# EAGLE design displayboard (EAGLE 8.2.1)
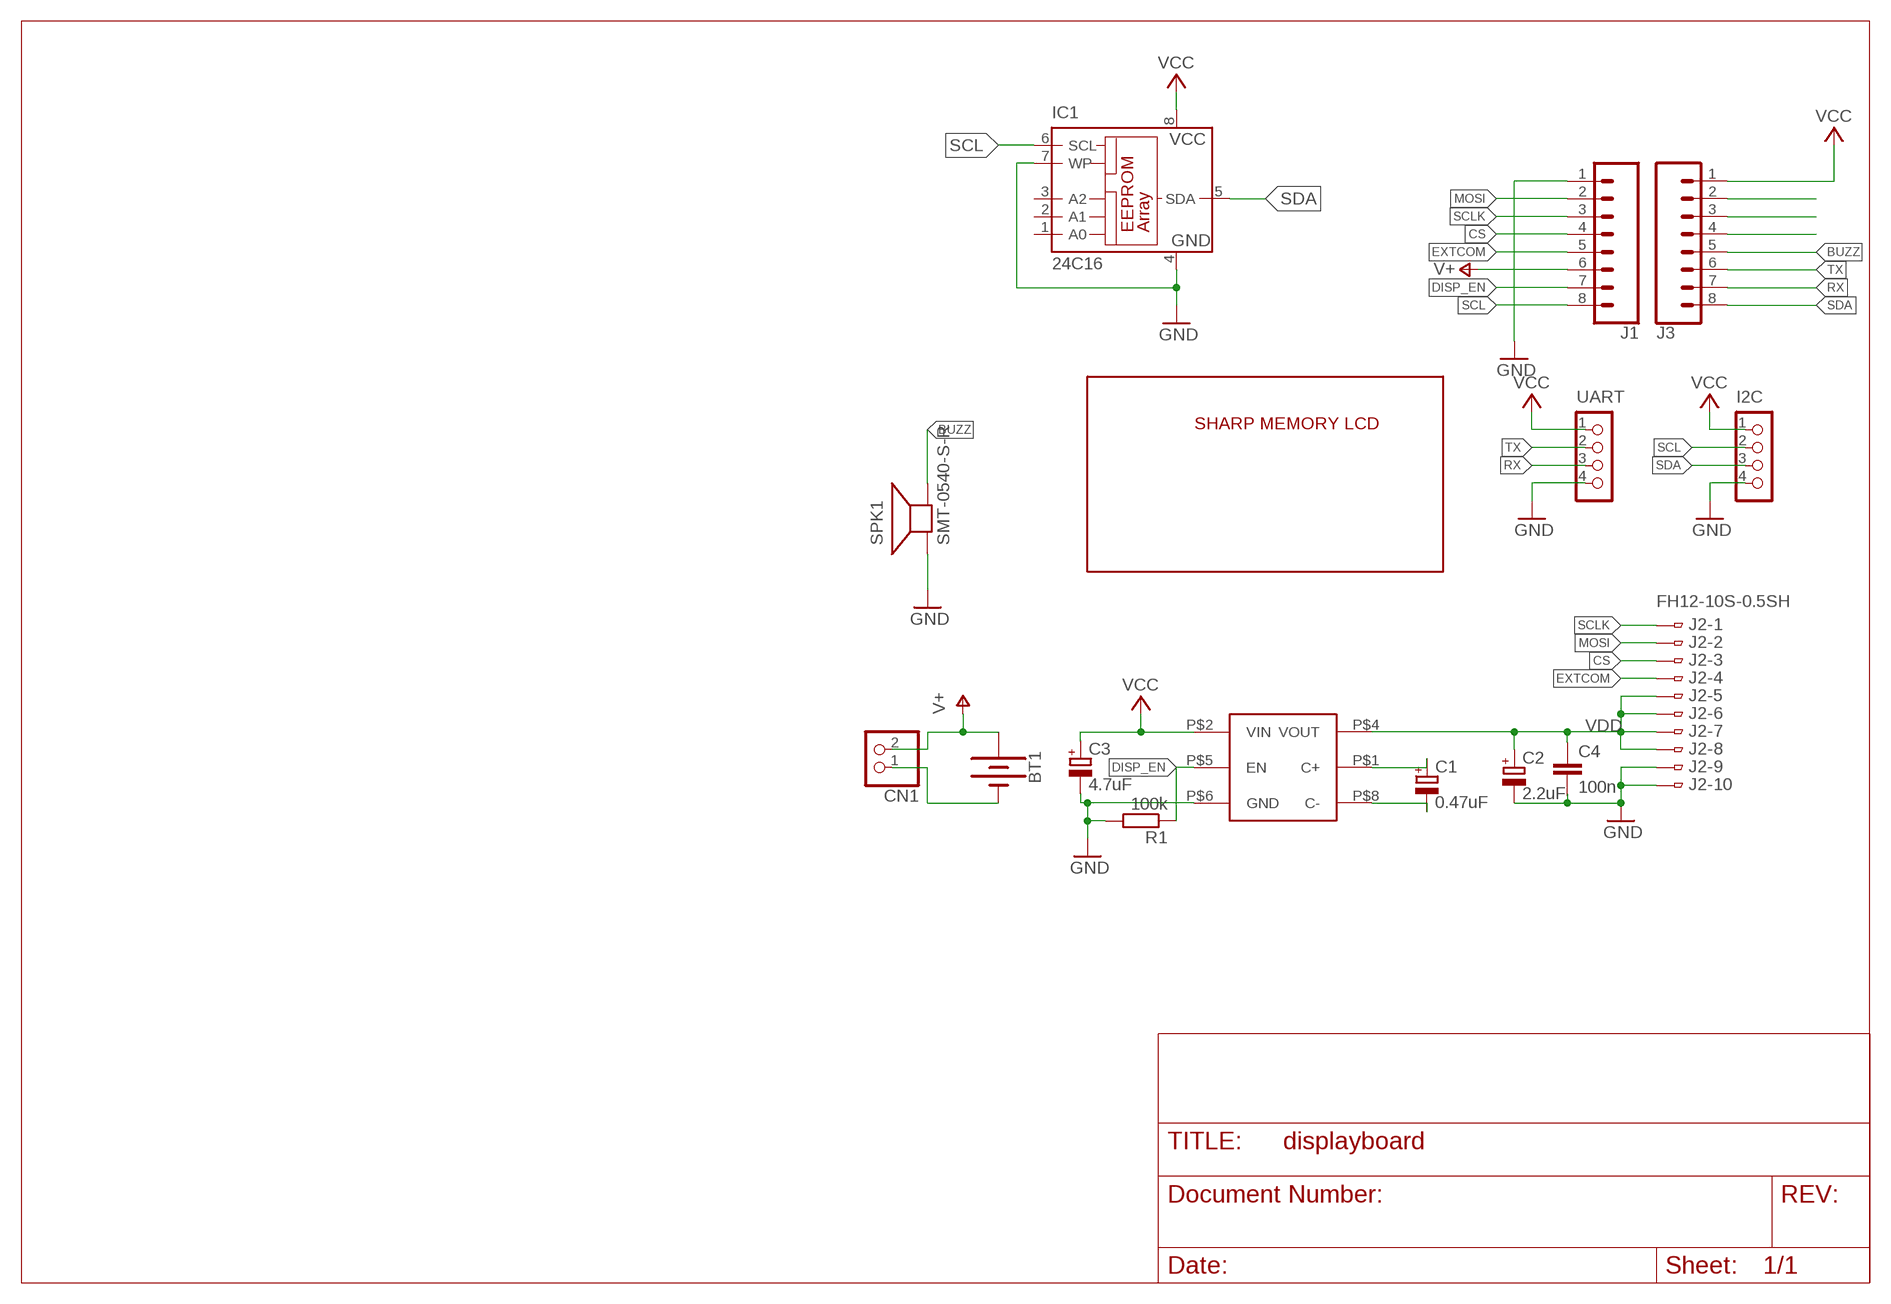
[diagram p0: schematic, sheet 1]

## Parts
BT1  BATTERY-18650  [BATTERY_18650-HOLDER]
C1  0.47uF  CPOL-EUC/6032-28R  [C/6032-28R]
C2  2.2uF  CPOL-EUC/6032-28R  [C/6032-28R]
C3  4.7uF  CPOL-EUC/6032-28R  [C/6032-28R]
C4  100n  C-EUC1206K  [C1206K]
CN1  PINHD-1X2  [1X02]
I2C  CON_HEADER_1X04  [M1X4]
IC1  24C16  24C04SN  [SO-08]
J1  CONN_08SMD-COMBO-FEMALE  [1X08_SMD_COMBINED]
J2  FH12-10S-0.5SH  [FH12-10S-0.5SH]
J3  CONN_08SMD-COMBO-FEMALE  [1X08_SMD_COMBINED]
R1  100k  R-EU_R0805  [R0805]
SPK1  SMT-0540-S-R  [SMT-0540-S-R]
U$1  S8821  [SNT-8A]
U$2  MEMORYLCD  [LS027B7DH01]
UART  CON_HEADER_1X04  [M1X4]

## Nets
BUZZ: J3.5 SPK1.+(-)
CS: J1.4 J2.3
DISP_EN: J1.7 R1.1 U$1.P$5(EN)
EXTCOM: J1.5 J2.4
GND: C2.- C3.- C4.2 I2C.4 IC1.4(GND) IC1.7(WP) J1.1 J2.9 J2.10 R1.2 SPK1.-(+) U$1.P$6(GND) UART.4
MOSI: J1.2 J2.2
N$1: J3.2
N$2: C1.+ U$1.P$1(C+)
N$4: C1.- U$1.P$8(C-)
N$5: BT1.GND@1(-) CN1.1
N$9: J3.3
N$10: J3.4
RX: J3.7 UART.3
SCL: I2C.2 IC1.6(SCL) J1.8
SCLK: J1.3 J2.1
SDA: I2C.3 IC1.5(SDA) J3.8
TX: J3.6 UART.2
V+: BT1.PWR@1(+) CN1.2 J1.6
VCC: C3.+ I2C.1 IC1.8(VCC) J3.1 U$1.P$2(VIN) UART.1
VDD: C2.+ C4.1 J2.5 J2.6 J2.7 J2.8 U$1.P$4(VOUT)
Unconnected: IC1.1(A0) IC1.2(A1) IC1.3(A2)

## Library data of the parts
BT1 = SparkFun-Batteries:BATTERY: Battery - Single Cell A variety of battery chemistries, sizes, and footprints. Device List: 20MM_PTH - Coin Cell Battery Holder - 20mm (PTH) <https://www.sparkfun.com/products/783> 12MM_SMD - Coin Cell Battery Holder - 12mm (SMD) <https://www.sparkfun.com/products/10592> 12MM_PTH - Coin Cell Battery Holder - 12mm (PTH) <https://www.sparkfun.com/products/7948> 20MM_SMD - 20mm Coin Cell Battery Holder (SMD) (2 legs) Used on the Big Time Watch Kit <https://www.sparkfun.com/products/11734> 20MM_SMD_4LEGS - Coin Cell Battery Holder - 20mm (SMD) <https://www.sparkfun.com/products/11892> 20MM_SMD_4LEGS_OVERPASTE - Coin Cell Battery Holder - 20mm (SMD) <https://www.sparkfun.com/products/11892> (Over-paste on the legs) 24.5MM_PTH - Coin Cell Battery Holder - 24.5mm (PTH) <https://www.sparkfun.com/products/8863> 9V - 9V Battery Holder - PC Mount Used on the SparkFun SparkPunk Sound Kit <https://www.sparkfun.com/products/11177> and SparkFun SparkPunk Sequencer Kit <https://www.sparkfun.com/products/12707> 18650 - Battery Holder - 18650 (PTH) <https://www.sparkfun.com/products/13113> AA - Battery Holder - 1xAA (PTH) <https://www.sparkfun.com/products/7949> AAA - Battery Holder - 1xAAA (PTH) <https://www.sparkfun.com/products/12718> AA_KIT - Battery Holder - 1xAA (PTH) <https://www.sparkfun.com/products/7949> Special kit package - pads only have exposed copper on one side of the board. AAA_KIT - Battery Holder - 1xAAA (PTH) <https://www.sparkfun.com/products/12718> Special kit package - pads only have exposed copper on one side of the board.; PROD_ID: BATT-12327; SF_SKU: PRT-13113
C1-C3 = rcl:CPOL-EU: POLARIZED CAPACITOR, European symbol
C4 = rcl:C-EU: CAPACITOR, European symbol
CN1 = pinhead:PINHD-1X2: PIN HEADER
I2C UART = dp_devices.v6:CON_HEADER_1X04
IC1 = microchip:24C*: Serial EEPROM 1 K/2 K/4 K; MPN: M24C04-WMN6P; OC_FARNELL: 9882812; OC_NEWARK: 83K1376
J1 J3 = SparkFun-Connectors:CONN_08: Multi connection point. Often used as Generic Header-pin footprint for 0.1 inch spaced/style header connections On any of the 0.1 inch spaced packages, you can populate with these: Break Away Headers - Straight <https://www.sparkfun.com/products/116> (PRT-00116) Break Away Male Headers - Right Angle <https://www.sparkfun.com/products/553> (PRT-00553) Female Headers <https://www.sparkfun.com/products/115> (PRT-00115) Break Away Headers - Machine Pin <https://www.sparkfun.com/products/117> (PRT-00117) Break Away Female Headers - Swiss Machine Pin <https://www.sparkfun.com/products/743> (PRT-00743) Arduino Stackable Header - 8 Pin <https://www.sparkfun.com/products/9279> (PRT-09279) For SCREWTERMINALS and SPRING TERMINALS visit here: Screw Terimnals on SparkFun.com <https://www.sparkfun.com/search/results?term=Screw+Terminals> (5mm/3.5mm/2.54mm spacing) This device is also useful as a general connection point to wire up your design to another part of your project. Our various solder wires solder well into these plated through hole pads. Hook-Up Wire - Assortment (Stranded, 22 AWG) <https://www.sparkfun.com/products/11375> (PRT-11375) Hook-Up Wire - Assortment (Solid Core, 22 AWG) <https://www.sparkfun.com/products/11367> (PRT-11367) View the entire wire category on our website here <https://www.sparkfun.com/categories/141> Special notes: Molex polarized connector foot print use with SKU : PRT-08231 with associated crimp pins and housings. 1MM SMD Version SKU: PRT-10208 NOTES ON THE VARIANTS LOCK and LOCK_LONGPADS... This footprint was designed to help hold the alignment of a through-hole component (i.e. 6-pin header) while soldering it into place. You may notice that each hole has been shifted either up or down by 0.005 of an inch from it's more standard position (which is a perfectly straight line). This slight alteration caused the pins (the squares in the middle) to touch the edges of the holes. Because they are alternating, it causes a "brace" to hold the component in place. 0.005 has proven to be the perfect amount of "off-center" position when using our standard breakaway headers. Although looks a little odd when you look at the bare footprint, once you have a header in there, the alteration is very hard to notice. Also,if you push a header all the way into place, it is covered up entirely on the bottom side.; PROD_ID: CONN-10204; SF_ID: PRT-11543
J2 = con-hirose:FH12-10S-0.5S: 0.5mm Pitch Connectors For FPC/FFC Source: Data sheet <http://www.hirose.co.jp/cataloge_hp/e58605370.pdf>; MPN: FH12-10S-0.5SH(55); OC_FARNELL: 1324540; OC_NEWARK: 34M6152
R1 = rcl:R-EU_: RESISTOR, European symbol
SPK1 = adafruit:SMT-0540-S-R: SMT-0549-S-R Small surface-mount magnetic buzzer
U$1 = SparkFun-Batteries:S8821
U$2 = SparkFun-Electromechanical:MEMORYLCD

## Board
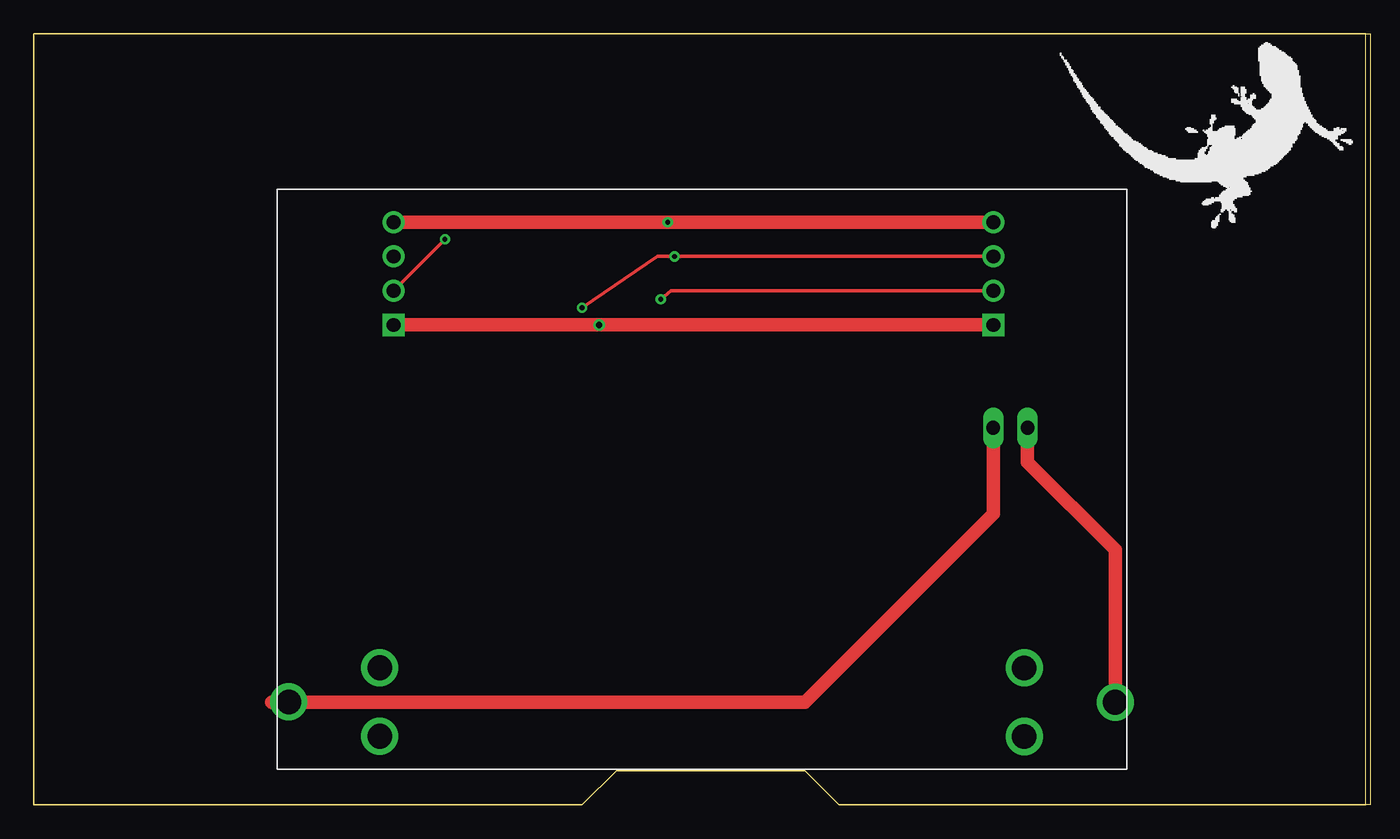
[diagram p1: board, top side]
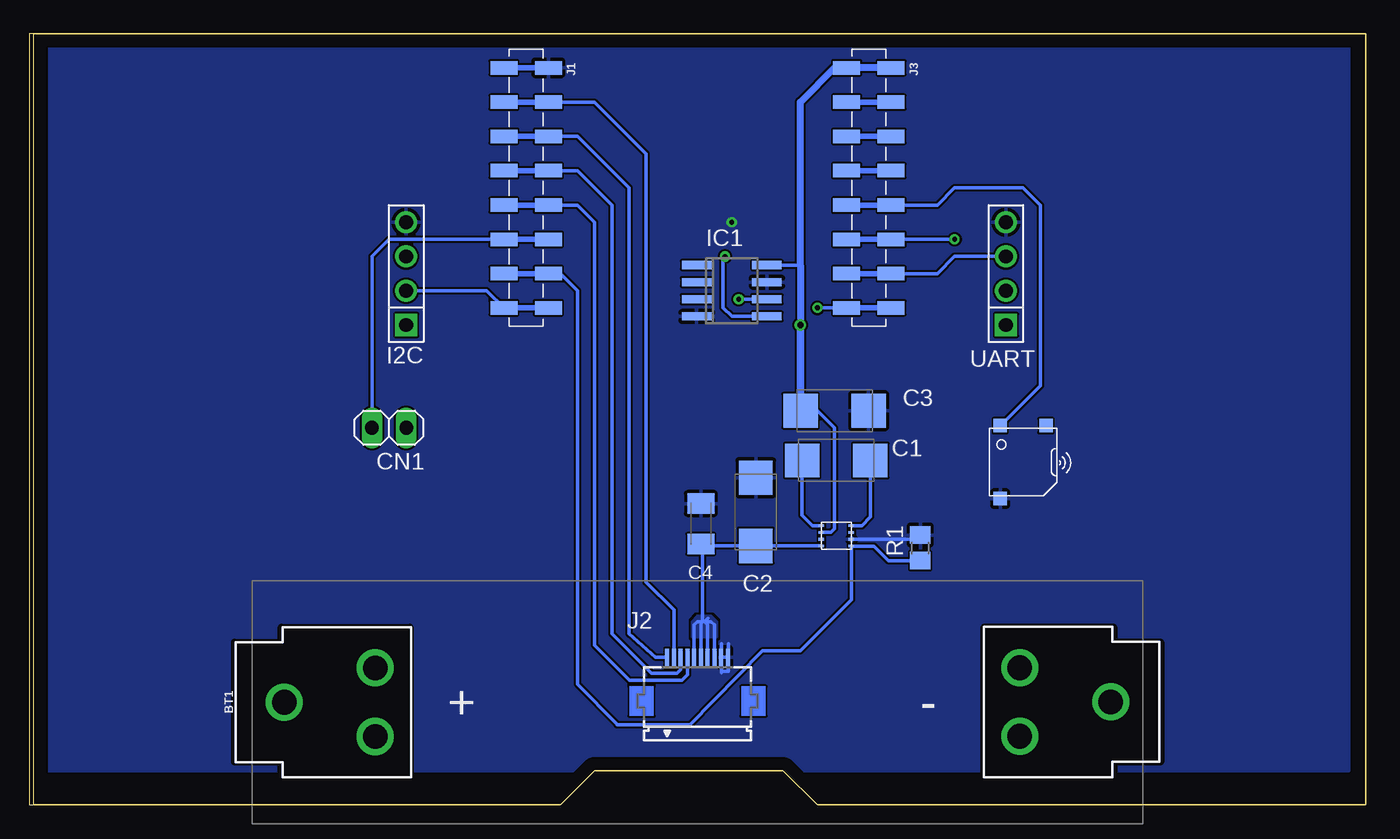
[diagram p2: board, bottom side, seen from below]

Size 98.73 x 57.14 mm. Coordinates in mm from the lower left corner, seen from the top.
Outline: 0,0 40.64,0 43.18,2.54 57.15,2.54 59.69,0 98.73,0 98.73,57.14 0,57.14 0,0
Copper layers (1*16): Top 0.035mm / dielectric 1.5mm / Bottom 0.035mm
Design rules "default *": minimum track width 6mil, minimum drill 0.35mm, track to track 6mil, track to pad 6mil, pad to pad 6mil, via to via 6mil, smd to smd 6mil, copper to edge 40mil, drill to drill 6mil, minimum pad ring 10mil, minimum via ring 8mil, stop-mask expansion 3mil, vias tented up to drill 0mil, thermal gap 10mil
Milling: 8 lines

### Footprints (pad centres in the part's own frame; a part is rotated, then mirrored left to right if it is on the bottom)
BATTERY_18650-HOLDER = drill 1.829: GND@1 30.628,0.01; GND@2 23.88,2.55; GND@3 23.88,-2.53; PWR@1 -30.628,-0.01; PWR@2 -23.88,2.53; PWR@3 -23.88,-2.55
C/6032-28R = smd 2.55 x 2.5: + 2.525,0; - -2.525,0
C1206K = smd 1.5 x 2: 1 -1.5,0; 2 1.5,0
1X02 = drill 1.016 long: 1 -1.27,0; 2 1.27,0
M1X4 = drill 1.02 pad 1.632 square: 1 0,0 | drill 1.02 pad 1.632: 2 2.54,0; 3 5.08,0; 4 7.62,0
SO-08 = smd 0.6 x 2.2: 1 -1.905,-2.6; 2 -0.635,-2.6; 3 0.635,-2.6; 4 1.905,-2.6; 5 1.905,2.6; 6 0.635,2.6; 7 -0.635,2.6; 8 -1.905,2.6
1X08_SMD_COMBINED = smd 1 x 2: 1 0,1.65; 1@2 0,-1.65; 2 2.54,-1.65; 2@2 2.54,1.65; 3 5.08,1.65; 3@2 5.08,-1.65; 4 7.62,-1.65; 4@2 7.62,1.65; 5 10.16,1.65; 5@2 10.16,-1.65; 6 12.7,-1.65; 6@2 12.7,1.65; 7 15.24,1.65; 7@2 15.24,-1.65; 8 17.78,-1.65; 8@2 17.78,1.65
FH12-10S-0.5SH = smd 0.3 x 1.3: 1 -2.25,3.25; 2 -1.75,3.25; 3 -1.25,3.25; 4 -0.75,3.25; 5 -0.25,3.25; 6 0.25,3.25; 7 0.75,3.25; 8 1.25,3.25; 9 1.75,3.25; 10 2.25,3.25
R0805 = smd 1.3 x 1.5: 1 -0.95,0; 2 0.95,0
SMT-0540-S-R = smd 1 x 1: + 1.7,-2.7; - 1.7,2.7; M -1.7,-2.7
SNT-8A = smd 0.406 x 0.203: P$1 -1.118,0.762; P$2 -1.118,0.254; P$3 -1.118,-0.254; P$4 -1.118,-0.762; P$5 1.118,-0.762; P$6 1.118,-0.254; P$7 1.118,0.254; P$8 1.118,0.762

### Placement (x,y rotation side)
BT1  49.53,7.62 0 bottom
C1  39.24,25.53 180 bottom
C2  45.21,21.72 270 bottom
C3  39.37,29.21 180 bottom
C4  49.28,20.83 90 bottom
CN1  72.39,27.94 180 bottom
I2C  71.12,35.56 90 bottom
IC1  46.99,38.1 270 bottom
J1  62.23,54.61 270 bottom
J2  49.53,7.69 0 bottom
J3  36.83,54.61 270 bottom
R1  33.02,19.05 90 bottom
SPK1  25.4,25.4 180 bottom
U$1  39.24,19.94 0 bottom
U$2  49.53,24.13 0 top
UART  26.67,35.56 90 bottom

### Tracks (layer width: path | path; a pad name or v marks a point on that pad's centre or on a via)
BUZZ
  Bottom 0.254: SPK1.+ 24.13,31.07 24.13,44.45 25.4,45.72 30.48,45.72 31.75,44.45 J3.5
CS
  Bottom 0.254: J2.3 50.78,10.02 51.05,9.75 52.93,9.75 55.88,12.7 55.88,44.45 58.42,46.99 J1.4
DISP_EN
  Bottom 0.254: R1.1 35.37,18.1 36.45,19.18 U$1.P$5 38.12,15.21 41.91,11.43 44.72,11.43 50.1,5.95 55.48,5.95 55.48,5.99 58.42,8.93 58.42,38.1 59.69,39.37 J1.7
EXTCOM
  Bottom 0.254: J2.4 50.28,9.63 50.67,9.24 54.56,9.24 57.15,11.83 57.15,43.18 58.42,44.45 J1.5
GND  (via drill 0.35)
  Top 1.016: UART.4 v46.99,43.18 I2C.4
  Bottom 0.254: J2.10 J2.9 | U$1.P$6 33.66,19.68 33.02,20.32 | 47.75,11.94 47.75,10.92 47.76,10.92 J2.9 | J2.9 47.75,10.91 47.75,9.78 47.62,9.91 47.24,9.91 47.24,11.94
  pour Bottom (isolate 0.152, rank 2): 1.27,58.42 97.79,58.42 97.79,2.54 1.27,2.54
MOSI
  Bottom 0.254: J2.2 51.28,14.45 53.34,16.51 53.34,48.26 57.15,52.07 J1.2
N$2
  Bottom 0.152: 41.78,25.51 C1.+
  Bottom 0.254: U$1.P$1 41.02,20.7 41.78,21.46 41.78,25.51
N$4
  Bottom 0.152: 36.7,25.51 C1.-
  Bottom 0.254: U$1.P$8 37.34,20.7 36.7,21.34 36.7,25.51
N$5
  Top 1.016: CN1.1 71.12,21.59 57.15,7.62 17.64,7.62 BT1.GND@1
RX
  Bottom 0.254: UART.3 30.48,40.64 31.75,39.37 35.08,39.37
  Bottom 0.508: J3.7 35.08,39.37
SCL  (via drill 0.35)
  Top 0.254: v46.48,37.47 47.24,38.1 I2C.2
  Bottom 0.254: I2C.2 65.15,38.1 J1.8 | IC1.6 v46.48,37.47
SCLK
  Bottom 0.254: J2.1 52.65,10.94 54.61,12.7 54.61,45.72 58.42,49.53 J1.3
SDA  (via drill 0.35)
  Top 0.254: v40.64,36.83 46.23,40.64 v47.5,40.64 I2C.3
  Bottom 0.254: 38.5,36.83 38.48,36.45 | 38.5,36.83 v40.64,36.83 | IC1.5 46.99,36.2 47.62,36.83 47.62,40.64 v47.5,40.64 | J3.8 38.5,36.83
TX  (via drill 0.35)
  Top 0.254: v30.48,41.91 UART.2
  Bottom 0.254: J3.6 v30.48,41.91
V+
  Top 1.016: CN1.2 73.66,25.4 80.16,18.9 BT1.PWR@1
  Bottom 0.254: CN1.2 73.66,40.64 72.39,41.91 J1.6
VCC  (via drill 0.45)
  Top 1.016: I2C.1 v41.91,35.56 UART.1
  Bottom 0.254: C3.+ 40.64,29.21 39.37,27.94 39.37,20.45 39.62,20.19 U$1.P$2 | IC1.8 41.91,40.01
  Bottom 0.508: C3.+ 41.91,29.23 v41.91,35.56 | v41.91,35.56 41.91,40.01 41.91,52.07 39.37,54.61 J3.1 | 41.91,29.21 v41.91,35.56
VDD
  Bottom 0.152: 49.15,13.59 49.02,13.59 | 48.77,12.13 J2.7
  Bottom 0.254: J2.8 48.28,13.36 48.51,13.59 49.02,13.59 | 49.15,13.59 49.53,13.59 49.78,13.34 49.78,12.14 J2.5 | J2.6 49.28,13.46 49.15,13.59 | J2.7 48.78,13.35 49.02,13.59 | 48.77,13.84 49.02,13.59 | U$1.P$4 40.38,19.19 C2.+ 49.14,19.19 49.15,19.2 | C4.1 49.15,19.2 | 49.15,19.2 49.15,13.59
  pour Bottom: 48.13,12.45 48.13,13.59 48.51,13.97 49.53,13.97 49.91,13.59 49.91,12.45

### Text on the board
tValues: Meeting Room Monitor | A Hack-A-Gecko project | by Steven Cooreman
bValues: RX | SDA | TX | SCL | + | - | + | + | +